# Altium schematic sheet Transmitter.SchDoc
size Letter
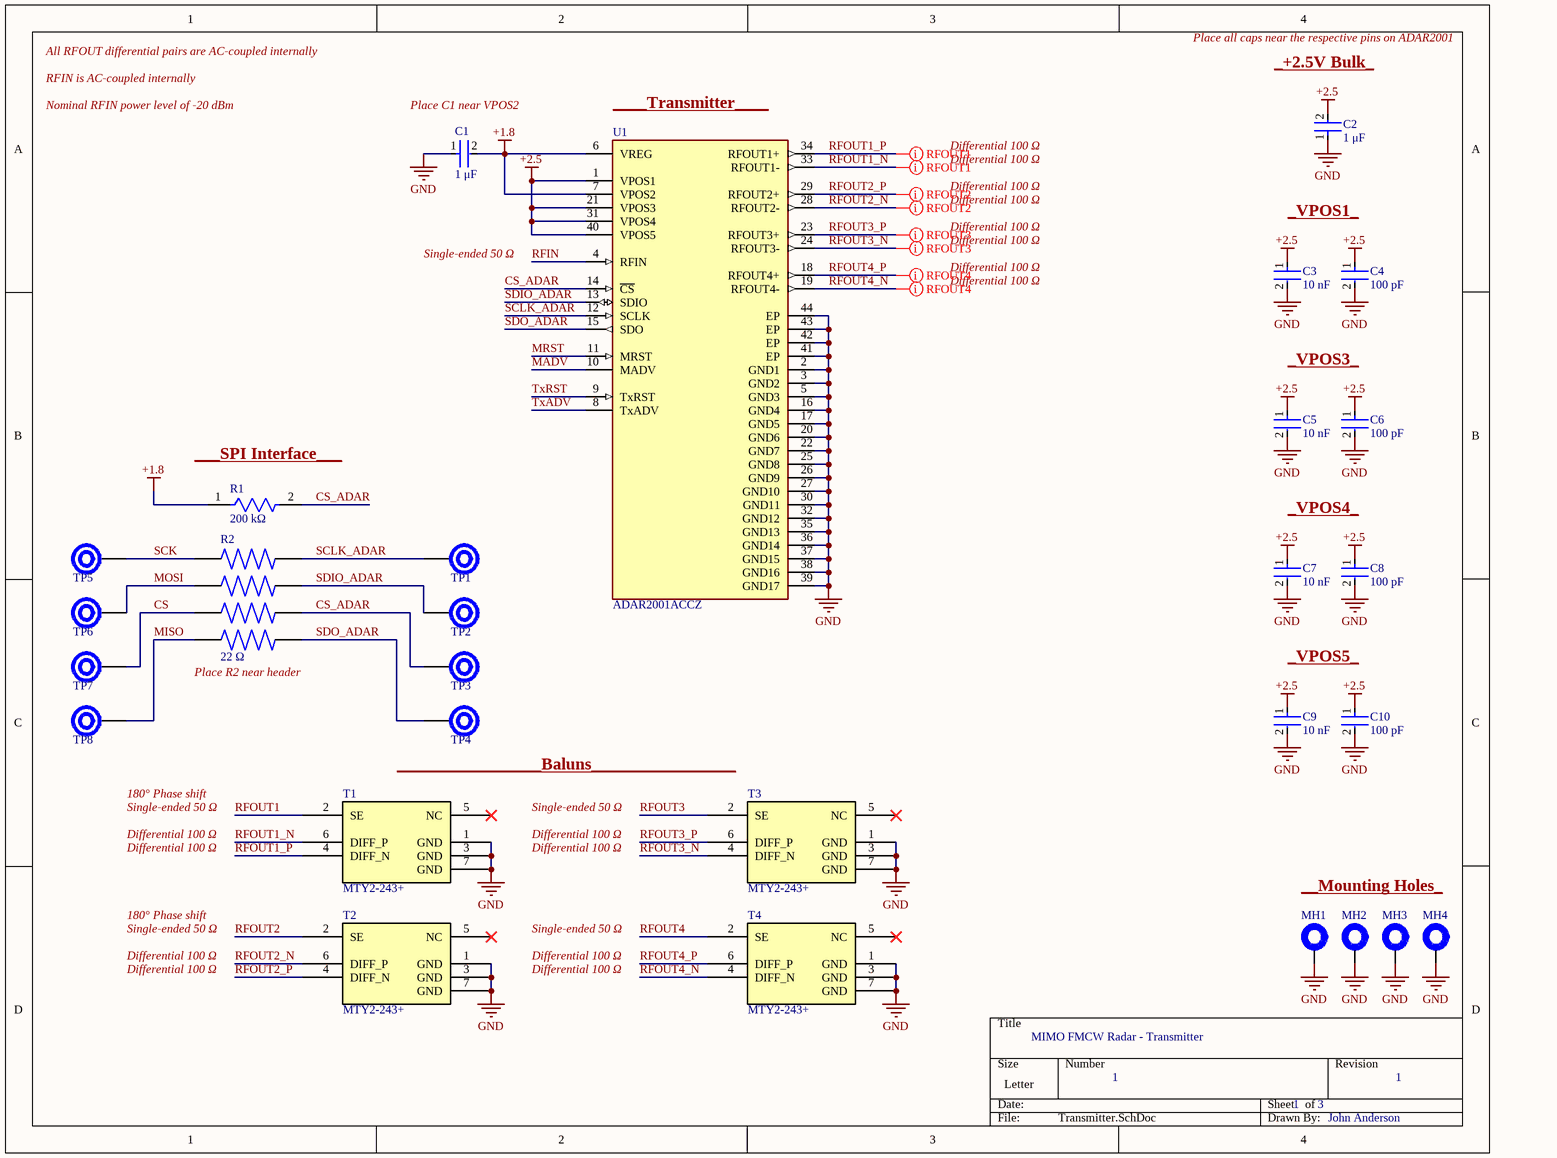
[diagram p0: Transmitter.SchDoc]

## Parts
C1  1 μF  [FP-0603-L_1_6_0_15-W_0_8-MFG]
C2  1 μF  [FP-0603-L_1_6_0_15-W_0_8-MFG]
C3  10 nF  [CGA3E2X7R1H103K080AA-Footprint-1]
C4  100 pF  [FP-C0603C-CF-IPC_C]
C5  10 nF  [CGA3E2X7R1H103K080AA-Footprint-1]
C6  100 pF  [FP-C0603C-CF-IPC_C]
C7  10 nF  [CGA3E2X7R1H103K080AA-Footprint-1]
C8  100 pF  [FP-C0603C-CF-IPC_C]
C9  10 nF  [CGA3E2X7R1H103K080AA-Footprint-1]
C10  100 pF  [FP-C0603C-CF-IPC_C]
MH1  M3 Plated Mounting Hole - Loose  [M3 Plated Mounting Hole-Footprint-1]  (value not drawn)
MH2  M3 Plated Mounting Hole - Loose  [M3 Plated Mounting Hole-Footprint-1]  (value not drawn)
MH3  M3 Plated Mounting Hole - Loose  [M3 Plated Mounting Hole-Footprint-1]  (value not drawn)
MH4  M3 Plated Mounting Hole - Loose  [M3 Plated Mounting Hole-Footprint-1]  (value not drawn)
R1  200 kΩ  [FP-RG1608-IPC_C]
R2  22 Ω  [CAY16-22R0F4LF-Footprint-1]
T1  MTY2-243+  [MTY2-243+-Footprint-1]
T2  MTY2-243+  [MTY2-243+-Footprint-1]
T3  MTY2-243+  [MTY2-243+-Footprint-1]
T4  MTY2-243+  [MTY2-243+-Footprint-1]
TP1  Test Point - 32 mil  [Test Point - 32 mil-Footprint-1]  (value not drawn)
TP2  Test Point - 32 mil  [Test Point - 32 mil-Footprint-1]  (value not drawn)
TP3  Test Point - 32 mil  [Test Point - 32 mil-Footprint-1]  (value not drawn)
TP4  Test Point - 32 mil  [Test Point - 32 mil-Footprint-1]  (value not drawn)
TP5  Test Point - 32 mil  [Test Point - 32 mil-Footprint-1]  (value not drawn)
TP6  Test Point - 32 mil  [Test Point - 32 mil-Footprint-1]  (value not drawn)
TP7  Test Point - 32 mil  [Test Point - 32 mil-Footprint-1]  (value not drawn)
TP8  Test Point - 32 mil  [Test Point - 32 mil-Footprint-1]  (value not drawn)
U1  ADAR2001ACCZ  [FP-CC-40-7-MFG]

## Nets
+1.8: C1.2 R1.1 U1.6(VREG) U1.7(VPOS2)
+2.5: C2.2 C3.1 C4.1 C5.1 C6.1 C7.1 C8.1 C9.1 C10.1 U1.1(VPOS1) U1.21(VPOS3) U1.31(VPOS4) U1.40(VPOS5)
GND: C1.1 C2.1 C3.2 C4.2 C5.2 C6.2 C7.2 C8.2 C9.2 C10.2 MH1.1 MH2.1 MH3.1 MH4.1 T1.1(GND) T1.3(GND) T1.7(GND) T2.1(GND) T2.3(GND) T2.7(GND) T3.1(GND) T3.3(GND) T3.7(GND) T4.1(GND) T4.3(GND) T4.7(GND) U1.2(GND1) U1.3(GND2) U1.5(GND3) U1.16(GND4) U1.17(GND5) U1.20(GND6) U1.22(GND7) U1.25(GND8) U1.26(GND9) U1.27(GND10) U1.30(GND11) U1.32(GND12) U1.35(GND13) U1.36(GND14) U1.37(GND15) U1.38(GND16) U1.39(GND17) U1.41(EP) U1.42(EP) U1.43(EP) U1.44(EP)
CS: R2.3 TP7.1
CS_ADAR: R1.2 R2.6 TP3.1 U1.14(~{CS})
MADV: U1.10(MADV)
MISO: R2.4 TP8.1
MOSI: R2.2 TP6.1
MRST: U1.11(MRST)
RFIN: U1.4(RFIN)
RFOUT1: T1.2(SE)
RFOUT1_N: T1.6(DIFF_P) U1.33(RFOUT1-)
RFOUT1_P: T1.4(DIFF_N) U1.34(RFOUT1+)
RFOUT2: T2.2(SE)
RFOUT2_N: T2.6(DIFF_P) U1.28(RFOUT2-)
RFOUT2_P: T2.4(DIFF_N) U1.29(RFOUT2+)
RFOUT3: T3.2(SE)
RFOUT3_N: T3.4(DIFF_N) U1.24(RFOUT3-)
RFOUT3_P: T3.6(DIFF_P) U1.23(RFOUT3+)
RFOUT4: T4.2(SE)
RFOUT4_N: T4.4(DIFF_N) U1.19(RFOUT4-)
RFOUT4_P: T4.6(DIFF_P) U1.18(RFOUT4+)
SCK: R2.1 TP5.1
SCLK_ADAR: R2.8 TP1.1 U1.12(SCLK)
SDIO_ADAR: R2.7 TP2.1 U1.13(SDIO)
SDO_ADAR: R2.5 TP4.1 U1.15(SDO)
TxADV: U1.8(TxADV)
TxRST: U1.9(TxRST)

Not connected (* = marked no-connect by the designer): T1 5(NC)*; T2 5(NC)*; T3 5(NC)*; T4 5(NC)*

## Layout directives
differential pair: RFOUT1_N, RFOUT1_P, RFOUT2_N, RFOUT2_P, RFOUT3_N, RFOUT3_P, RFOUT4_N, RFOUT4_P

## Notes on the sheet
- All RFOUT differential pairs are AC-coupled internally
- RFIN is AC-coupled internally
- Place all caps near the respective pins on ADAR2001
- (near C2) _+2.5V Bulk_
- Nominal RFIN power level of -20 dBm
- (near C1) Place C1 near VPOS2
- (near U1) ____Transmitter____
- Differential 100 Ω
- _VPOS1_
- Single-ended 50 Ω
- _VPOS3_
- (near R1) ___SPI Interface___
- _VPOS4_
- (near R2) Place R2 near header
- _VPOS5_
- _________________Baluns_________________
- 180° Phase shift
- __Mounting Holes_
- MIMO FMCW Radar - Transmitter
- 1
- 3
- John Anderson

## Library data of the parts
C1 C2 = CMP-00100-1: Ceramic Capacitor, Multilayer, Ceramic, 50V, 10% +Tol, 10% -Tol, X7R, 15% TC, 1uF, Surface Mount, 0603; Multilayer: Yes; Packaging: Tape and Reel; Dielectric Material: Ceramic; Terminal Finish: Tin; Min Operating Temperature: -55°C; Mounting Technology: Surface Mount; Pins: 2; Rated DC Voltage (URdc): 50V; Tolerance (fill in as +-): 10%; Package Style: SMTMeter; Length: 1.6mm; RoHS Compliant: Yes; Temperature Characteristics Code: X7R; Value: 1uF; Tolerance  (fill in as +-): 10%; Max Operating Temperature: 125°C; JESD-609 Code: e3; Package Shape: Rectangular; Termination: Wraparound; Reach SVHC Compliant: Yes; Case/Package: 0603; Width: 0.8mm; Capacitor Type: Ceramic; Height: 0.8mm
C3 C5 C7 C9 = CMP-00157-1: CGA Series 0603 10 nF 50 V ±10 % Tolerance X7R SMT Multilayer Ceramic Capacitor; Manufacturer Lifecycle Status: PRODUCTION; Voltage Rating: 50V; Value: 10nF; Tolerance: 10%; Weight: 2.012816mg; Min Width: 700µm; Lead Free: Lead Free; Voltage Rating (DC): 50V; Max Length: 1.7mm; Width: 800µm; Schedule B: 8532240020, 8532240020; Thickness: 889µm; China RoHS: Compliant; Height: 800µm; Material: Ceramic; REACH SVHC: Yes; RoHS: Compliant; Dielectric: X7R; Length: 1.6mm; Ratings: AEC-Q200; Mounting Technology: Surface Mount; Composition: Ceramic; Case/Package: 0603; Termination: SMD/SMT; Dielectric Material: Ceramic; Lifecycle Status: Production; Min Operating Temperature: -55°C; Max Operating Temperature: 125°C; Number of Terminals: 2; Case Code (Metric): 1608; Case Code (Imperial): 0603; Max Width: 900µm; Min Length: 1.5mm
C4 C6 C8 C10 = CMP-00365-1: Multilayer Ceramic Capacitors MLCC – SMD/SMT; KEMET; C0603C101J5GACTU; 100 pF; 0603; 50 V; 50 V; Voltage: 50V; Tolerance: 5%; Dielectric: C0G; Temperature Coefficient: 30ppm/°C; Dissipation Factor: 0.1%; Value: 100pF; Contact Material: Tin; Schedule B: 8532240020, 8532240020; Termination: SMD/SMT; Packaging: Cut Tape; Country of Origin: Mainland China, Mexico; RoHS: Compliant; Height: 800µm; Voltage Rating (AC): 50V; Material: Ceramic; Lifecycle Status: Production; Number of Terminals: 2; Voltage Rating: 50V; Case/Package: 0603; Mounting Technology: Surface Mount; Length: 1.6mm; Min Operating Temperature: -55°C; Width: 800µm; Introduction Date: 1997-02-01; Lead Pitch: 700µm; China RoHS: Compliant; Depth: 800µm; Harmonized Tariff Schedule (HTS) Code: 8532.24.00.20; REACH SVHC: Yes; Dielectric Material: Ceramic; Lead Free: Lead Free; Case Code (Imperial): 0603; Radiation Hardening: No; Voltage Rating (DC): 50V; Export Control Classification Number (ECCN) Code: EAR99; Max Operating Temperature: 125°C; Thickness: 863.6µm; Pins: 2
MH1-MH4 = CMP-00204-1: Plated M3 mounting hole with loose tolerance. 3.6 mm hole diameter, 4.6 mm plated diameter.
R1 = CMP-00366-1: Res Thin Film 0603 200K Ohm 0.1% 0.1W(1/10W) ±25ppm/C Sulfur Resistant Pad SMD Automotive T/R; Voltage Rating (DC): 75V; Working Voltage: 100V; Temperature Coefficient: 25ppm/°C; Max Power Dissipation: 100mW; Value: 200kΩ; Number of Terminals: 2; Height: 400µm; Composition: Thin Film; RoHS: Compliant; Number of Terminations: 2; Lifecycle Status: Production; REACH SVHC: Yes; Termination: SMD/SMT; Tolerance: 0.1%; Weight: 2.012816mg; Case Code (Metric): 1608; Power Dissipation: 100mW; Max Operating Temperature: 155°C; Voltage Rating: 100V; Export Control Classification Number (ECCN) Code: EAR99; Min Operating Temperature: -55°C; Harmonized Tariff Schedule (HTS) Code: 8533.21.00.30; Mounting Technology: Surface Mount; Lead Free: Lead Free; Case Code (Imperial): 0603; Schedule B: 8533210045; Length: 1.6mm; Width: 800µm; Power Rating: 100mW; Introduction Date: 2006-03-30; Features: Automotive AEC-Q200; Case/Package: 0603; Country of Origin: Mainland China, Japan
R2 = CMP-00370-1: Res Thick Film Array 22 Ohm 1% 0.25W(1/4W) ±200ppm/C ISOL 8-Pin 1206(4 X 0603) Convex SMD T/R; Temperature Coefficient: 200ppm/°C; Power Per Element: 62.5mW; Number of Elements: 1; Power Dissipation: 250mW; Number of Resistors: 4; Voltage Rating (DC): 50V; Value: 22Ω; Circuit Type: Isolated; REACH SVHC: Yes; Depth: 1.6mm; Case/Package: 1206; Case Code (Imperial): 1206; Lead Pitch: 800µm; Width: 1.6mm; China RoHS: Non-Compliant; Pins: 8; Introduction Date: 2003-04-07; Case Code (Metric): 3216; Schedule B: 8533210025, 8533210025; Mounting Technology: Surface Mount; Termination: Convex; Export Control Classification Number (ECCN) Code: EAR99; Min Operating Temperature: -55°C; Military Standard: Not; Tolerance: 1%; Height: 500µm; Number of Circuits: 4; Lifecycle Status: Production; Working Voltage: 50V; RoHS: Compliant; Max Operating Temperature: 125°C; Contact Plating: Tin; Number of Terminals: 8; Length: 3.2mm; Terminal Pitch: 800µm
T1-T4 = CMP-00368-1: RF Transformer, 10000MHz Min, 24000MHz Max; Insertion Loss (dB): 2.2dB; Clock Frequency: 24GHz; Height: 1mm; Max Operating Temperature: 85°C; Mounting Technology: Surface Mount; Export Control Classification Number (ECCN) Code: EAR99; RoHS: Compliant; Width: 2mm; Length: 2mm; Lifecycle Status: Production; Min Operating Temperature: -40°C; Introduction Date: 2019-12-24
TP1-TP8 = CMP-00284-1: 32 mil (0.8 mm) test point.
U1 = CMP-00364-1: Active RF Multipliers x4 10GHz to 40GHz-OUT 40-Pin LGA EP Tray; Manufacturer Lifecycle Status: PRODUCTION; Bandwidth: 7.5GHz; Max Junction Temperature (Tj): 135°C; Clock Frequency: 40GHz; RoHS: Compliant; Lifecycle Status: Production; Height: 780µm; Pins: 40; Max Operating Temperature: 85°C; Min Operating Temperature: -40°C; Schedule B: 8542390000